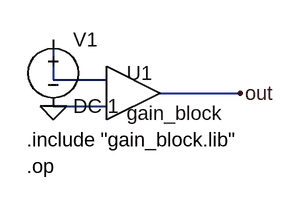
[diagram p0: schematic ltspice_subckt.asc]
ltspice_subckt.asc, the LTspice schematic file:
Version 4
SHEET 1 880 680
WIRE 0 16 0 64
WIRE 0 64 64 64
WIRE 0 96 64 96
WIRE 128 80 224 80
FLAG 0 96 0
FLAG 224 80 out
SYMBOL voltage 0 0 R0
SYMATTR InstName V1
SYMATTR Value DC 1
SYMBOL gain_block 64 48 R0
SYMATTR InstName U1
SYMATTR Value gain_block
TEXT -32 136 Left 2 !.include "gain_block.lib"
TEXT -32 168 Left 2 !.op

The netlist it stands for:
* ltspice_subckt.asc
V1 N001 0 DC 1
XU1 N001 out 0 gain_block  ; pins IN OUT COM
.include "gain_block.lib"
.op
.backanno
.end